# Altium schematic sheet Buck_boost_converter.SchDoc: +3V3 buck/boost converter.
size 297 x 209 mm; Author: Dmitry Shpakov; Organization: NoName; Revision: Revision; SheetNumber: 4; SheetTotal: 5; PageSize: A4; ProjectName: Project Name
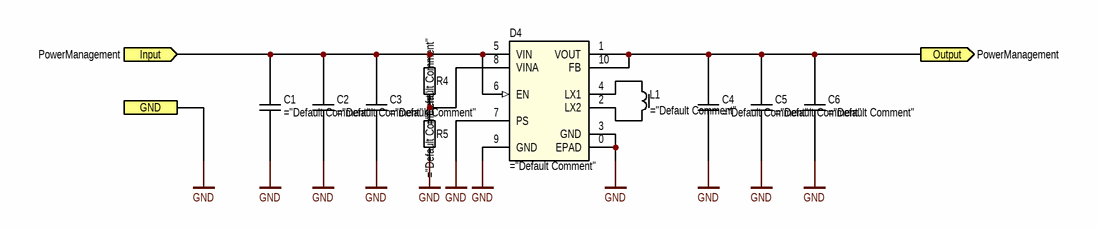
[diagram p0: Buck_boost_converter.SchDoc]

## Parts
C1  (no value)
C2  (no value)
C3  (no value)
C4  (no value)
C5  (no value)
C6  (no value)
D4  (no value)
L1  (no value)
R4  (no value)
R5  (no value)

## Ports
GND (see PowerManagement, Li-ion_charger, PowerManagement), Input (in, see PowerManagement), Output (out, see PowerManagement)

## Nets
GND: C1.1 C2.2 C3.2 C4.2 C5.2 C6.1 D4.0(EPAD) D4.3(GND) D4.7(PS) D4.9(GND) R5.1 ; port GND
Input: C1.2 C2.1 C3.1 D4.5(VIN) D4.6(EN) R4.2 ; port Input
Output: C4.1 C5.1 C6.2 D4.1(VOUT) D4.10(FB) ; port Output
NetD4_2: D4.2(LX2) L1.2
NetD4_4: D4.4(LX1) L1.1
NetD4_8: D4.8(VINA) R4.1 R5.2

## Notes on the sheet
- Author
- Date
- Organization
- Page
- Total pages
- Materials
- Page size

## Library data of the parts
C1 C6 = CC0805KKX5R6BB105: CAP CER 1UF 10V X5R 0805; Manufacturer: YAGEO; Type: capacitor; Power Dissipation: * W; Rated Current: * A; Tolerance: 10 %; Other: 1 µF ±10% 10V Ceramic Capacitor X5R 0805 (2012 Metric); Operating Temperature: -55 °C to +85 °C; HelpURL: https://www.digikey.com/en/products/detail/yageo/CC0805KKX5R6BB105/2345239; Default Comment: 1 uF; Rated Voltage: 10 V; Rated Power: * W; Value: 1 uF; Summary: ="Type"+" "+"Part Number"+" "+"Manufacturer"+" "+"Value"+" "+"Tolerance"+" "+"Operating Temperature"+" "+"Case"+" "+"Power Dissipation"+" "+"Rated Current"+" "+"Rated Power"+" "+"Rated Voltage"+" "+"Other"; Assembly: *; Case: 0805; Part Number: CC0805KKX5R6BB105
C2-C5 = CC0805KPX5R6BB106: CAP CER 10UF 10V X5R 0805; Manufacturer: YAGEO; Type: capacitor; Power Dissipation: * W; Rated Current: * A; Tolerance: 10 %; Other: 10 µF ±10% 10V Ceramic Capacitor X5R 0805 (2012 Metric); Operating Temperature: -55 °C to +85 °C; HelpURL: https://www.digikey.com/en/products/detail/yageo/CC0805KPX5R6BB106/11611309; Default Comment: 10 uF; Rated Voltage: 10 V; Rated Power: * W; Value: 10 uF; Summary: ="Type"+" "+"Part Number"+" "+"Manufacturer"+" "+"Value"+" "+"Tolerance"+" "+"Operating Temperature"+" "+"Case"+" "+"Power Dissipation"+" "+"Rated Current"+" "+"Rated Power"+" "+"Rated Voltage"+" "+"Other"; Assembly: *; Case: 0805; Part Number: CC0805KPX5R6BB106
D4 = RT6150B-33GQW: IC REG BCK BST 3.3V 800MA 10WDFN; Manufacturer: Richtek USA Inc.; Power Dissipation: * W; Tolerance: * %; Other: Buck-Boost Switching Regulator IC Positive Fixed 3.3V 1 Output 800mA 10-WFDFN Exposed Pad; Operating Temperature: -40 °C to +85 °C; Type: ic; HelpURL: https://www.digikey.com/en/products/detail/richtek-usa-inc/RT6150B-33GQW/6676709; Default Comment: RT6150B-33GQW; Rated Voltage: 3.3 V; Rated Current: 800 mA; Rated Power: * W; Value: *; Summary: ="Type"+" "+"Part Number"+" "+"Manufacturer"+" "+"Value"+" "+"Tolerance"+" "+"Operating Temperature"+" "+"Case"+" "+"Power Dissipation"+" "+"Rated Current"+" "+"Rated Power"+" "+"Rated Voltage"+" "+"Other"; Assembly: *; Case: 10-WDFN (2.5x2.5); Part Number: RT6150B-33GQW
L1 = 74479887222C: FIXED IND 2.2UH 1.6A 110MOHM SMD; Manufacturer: Würth Elektronik; Type: inductor; Power Dissipation: * W; Rated Voltage: * V; Tolerance: * %; Other: 2.2 µH Shielded Multilayer Inductor 1.6 A 110mOhm 1008 (2520 Metric); Operating Temperature: -40 °C to +125 °C; HelpURL: https://www.digikey.com/en/products/detail/w%C3%BCrth-elektronik/74479887222C/5870496; Default Comment: 2.2 uH; Rated Current: 1.6 A; Rated Power: * W; Value: 2.2 uH; Summary: ="Type"+" "+"Part Number"+" "+"Manufacturer"+" "+"Value"+" "+"Tolerance"+" "+"Operating Temperature"+" "+"Case"+" "+"Power Dissipation"+" "+"Rated Current"+" "+"Rated Power"+" "+"Rated Voltage"+" "+"Other"; Assembly: *; Case: 1008; Part Number: 74479887222C
R4 = RC0603FR-0756KL: RES 56K OHM 1% 1/10W 0603; Manufacturer: YAGEO; Rated Voltage: * V; Rated Current: * A; Other: 56 kOhms ±1% 0.1W, 1/10W Chip Resistor 0603 (1608 Metric) Moisture Resistant Thick Film; Operating Temperature: -55 °C to +155 °C; Type: resistor; HelpURL: https://www.digikey.com/en/products/detail/yageo/RC0603FR-0756KL/2827626; Default Comment: 56k; Power Dissipation: 1/10 W; Rated Power: 1/10 W; Tolerance: 1 %; Value: 56k; Summary: ="Type"+" "+"Part Number"+" "+"Manufacturer"+" "+"Value"+" "+"Tolerance"+" "+"Operating Temperature"+" "+"Case"+" "+"Power Dissipation"+" "+"Rated Current"+" "+"Rated Power"+" "+"Rated Voltage"+" "+"Other"; Assembly: *; Case: 0603; Part Number: RC0603FR-0756KL
R5 = RC0603FR-0786K6L: RES 86.6K OHM 1% 1/10W 0603; Manufacturer: YAGEO; Default Comment: 86k6; Rated Voltage: * V; Rated Current: * A; Value: 86k6; Other: 86.6 kOhms ±1% 0.1W, 1/10W Chip Resistor 0603 (1608 Metric) Moisture Resistant Thick Film; Operating Temperature: -55 °C to +155 °C; Type: resistor; HelpURL: https://www.digikey.com/en/products/detail/yageo/RC0603FR-0786K6L/727411?s=N4IgjCBcoMxaBjKAzAhgGwM4FMA0IB7KAbXDBggF18AHAFyhAGU6AnASwDsBzEAX3xgAbPBBJIaLHkIkQMAJwAmACwjqIeoxYce-fIoAMADgCso8ZJz4ikUkaEA6IQAIA1gHkAFgFtMIdZqQIACqnOx07sgAstiomACurNh6IAC0ENBiKBhWMrbgcJQCaYrmUGzx0jakZkXFIpnsACaM6QaltAxBIPh0AJ40yUFNmEh8fEA; Power Dissipation: 1/10 W; Rated Power: 1/10 W; Tolerance: 1 %; Summary: ="Type"+" "+"Part Number"+" "+"Manufacturer"+" "+"Value"+" "+"Tolerance"+" "+"Operating Temperature"+" "+"Case"+" "+"Power Dissipation"+" "+"Rated Current"+" "+"Rated Power"+" "+"Rated Voltage"+" "+"Other"; Assembly: *; Case: 0603; Part Number: RC0603FR-0786K6L